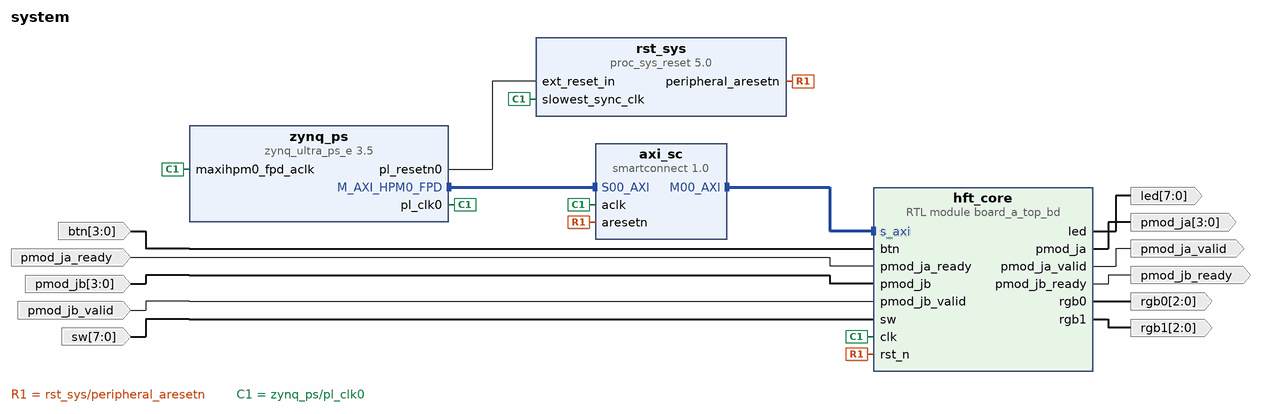
[diagram p0: block diagram of the top level]
# Vivado block design system, xczu3eg-sfvc784-2-e, Vivado 2025.2
create_bd_design system

create_bd_port -dir I -from 3 -to 0 btn
create_bd_port -dir I -from 7 -to 0 sw
create_bd_port -dir I pmod_ja_ready
create_bd_port -dir I -from 3 -to 0 pmod_jb
create_bd_port -dir I pmod_jb_valid
create_bd_port -dir O -from 7 -to 0 led
create_bd_port -dir O -from 2 -to 0 rgb0
create_bd_port -dir O -from 2 -to 0 rgb1
create_bd_port -dir O -from 3 -to 0 pmod_ja
create_bd_port -dir O pmod_ja_valid
create_bd_port -dir O pmod_jb_ready

create_bd_cell -type ip -vlnv xilinx.com:ip:zynq_ultra_ps_e:3.5 zynq_ps
set_property -dict [list \
  CONFIG.PSU__CRL_APB__PL0_REF_CTRL__FREQMHZ 50 \
  CONFIG.PSU__DDR_HIGH_ADDRESS_GUI_ENABLE 0 \
  CONFIG.PSU__FPGA_PL0_ENABLE 1 \
  CONFIG.PSU__MAXIGP0__DATA_WIDTH 32 \
  CONFIG.PSU__USE__M_AXI_GP0 1 \
  CONFIG.PSU__USE__M_AXI_GP1 0 \
  CONFIG.PSU__USE__M_AXI_GP2 0 \
] [get_bd_cells zynq_ps]
# 30 more settings of zynq_ps are not shown: defaults, MIO pin electricals, DDR timing, and values the tool derives
create_bd_cell -type module -reference board_a_top_bd hft_core
create_bd_cell -type ip -vlnv xilinx.com:ip:smartconnect:1.0 axi_sc
set_property -dict {CONFIG.NUM_MI 1 CONFIG.NUM_SI 1} [get_bd_cells axi_sc]
create_bd_cell -type ip -vlnv xilinx.com:ip:proc_sys_reset:5.0 rst_sys

# ---- connections ----

connect_bd_intf_net [get_bd_intf_pins axi_sc/M00_AXI] [get_bd_intf_pins hft_core/s_axi]
connect_bd_intf_net [get_bd_intf_pins zynq_ps/M_AXI_HPM0_FPD] [get_bd_intf_pins axi_sc/S00_AXI]
connect_bd_net [get_bd_ports btn] [get_bd_pins hft_core/btn]
connect_bd_net [get_bd_pins hft_core/led] [get_bd_ports led]
connect_bd_net [get_bd_pins hft_core/pmod_ja] [get_bd_ports pmod_ja]
connect_bd_net [get_bd_pins hft_core/pmod_ja_valid] [get_bd_ports pmod_ja_valid]
connect_bd_net [get_bd_pins hft_core/pmod_jb_ready] [get_bd_ports pmod_jb_ready]
connect_bd_net [get_bd_pins hft_core/rgb0] [get_bd_ports rgb0]
connect_bd_net [get_bd_pins hft_core/rgb1] [get_bd_ports rgb1]
connect_bd_net [get_bd_ports pmod_ja_ready] [get_bd_pins hft_core/pmod_ja_ready]
connect_bd_net [get_bd_ports pmod_jb] [get_bd_pins hft_core/pmod_jb]
connect_bd_net [get_bd_ports pmod_jb_valid] [get_bd_pins hft_core/pmod_jb_valid]
connect_bd_net [get_bd_pins rst_sys/peripheral_aresetn] [get_bd_pins hft_core/rst_n] [get_bd_pins axi_sc/aresetn]
connect_bd_net [get_bd_ports sw] [get_bd_pins hft_core/sw]
connect_bd_net [get_bd_pins zynq_ps/pl_clk0] \
  [get_bd_pins hft_core/clk] [get_bd_pins axi_sc/aclk] [get_bd_pins rst_sys/slowest_sync_clk] \
  [get_bd_pins zynq_ps/maxihpm0_fpd_aclk]
connect_bd_net [get_bd_pins zynq_ps/pl_resetn0] [get_bd_pins rst_sys/ext_reset_in]

# ---- address map ----
assign_bd_address -offset 0x00A0000000 -range 4K -target_address_space [get_bd_addr_spaces zynq_ps/Data] [get_bd_addr_segs hft_core/s_axi/reg0]

validate_bd_design
save_bd_design
